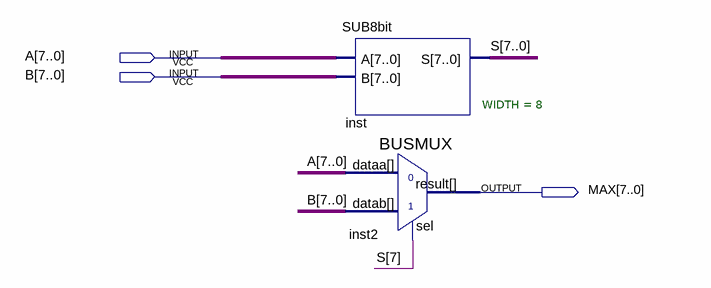
[diagram p0: schematic sheet]
// Quartus schematic MAX.bdf as structural Verilog: 2 symbols, 3 pins
module MAX (
  input  [7:0] A,
  input  [7:0] B,
  output [7:0] MAX
);

  wire [7:0] S;

  SUB8bit inst (.A(A), .B(B), .S(S));
  BUSMUX #(.WIDTH(8)) inst2 (.datab(B), .sel(S[7]), .dataa(A), .result(MAX));
endmodule
